# Altium schematic sheet P11-CAMERA AVIN.SchDoc
size 420 x 297 mm
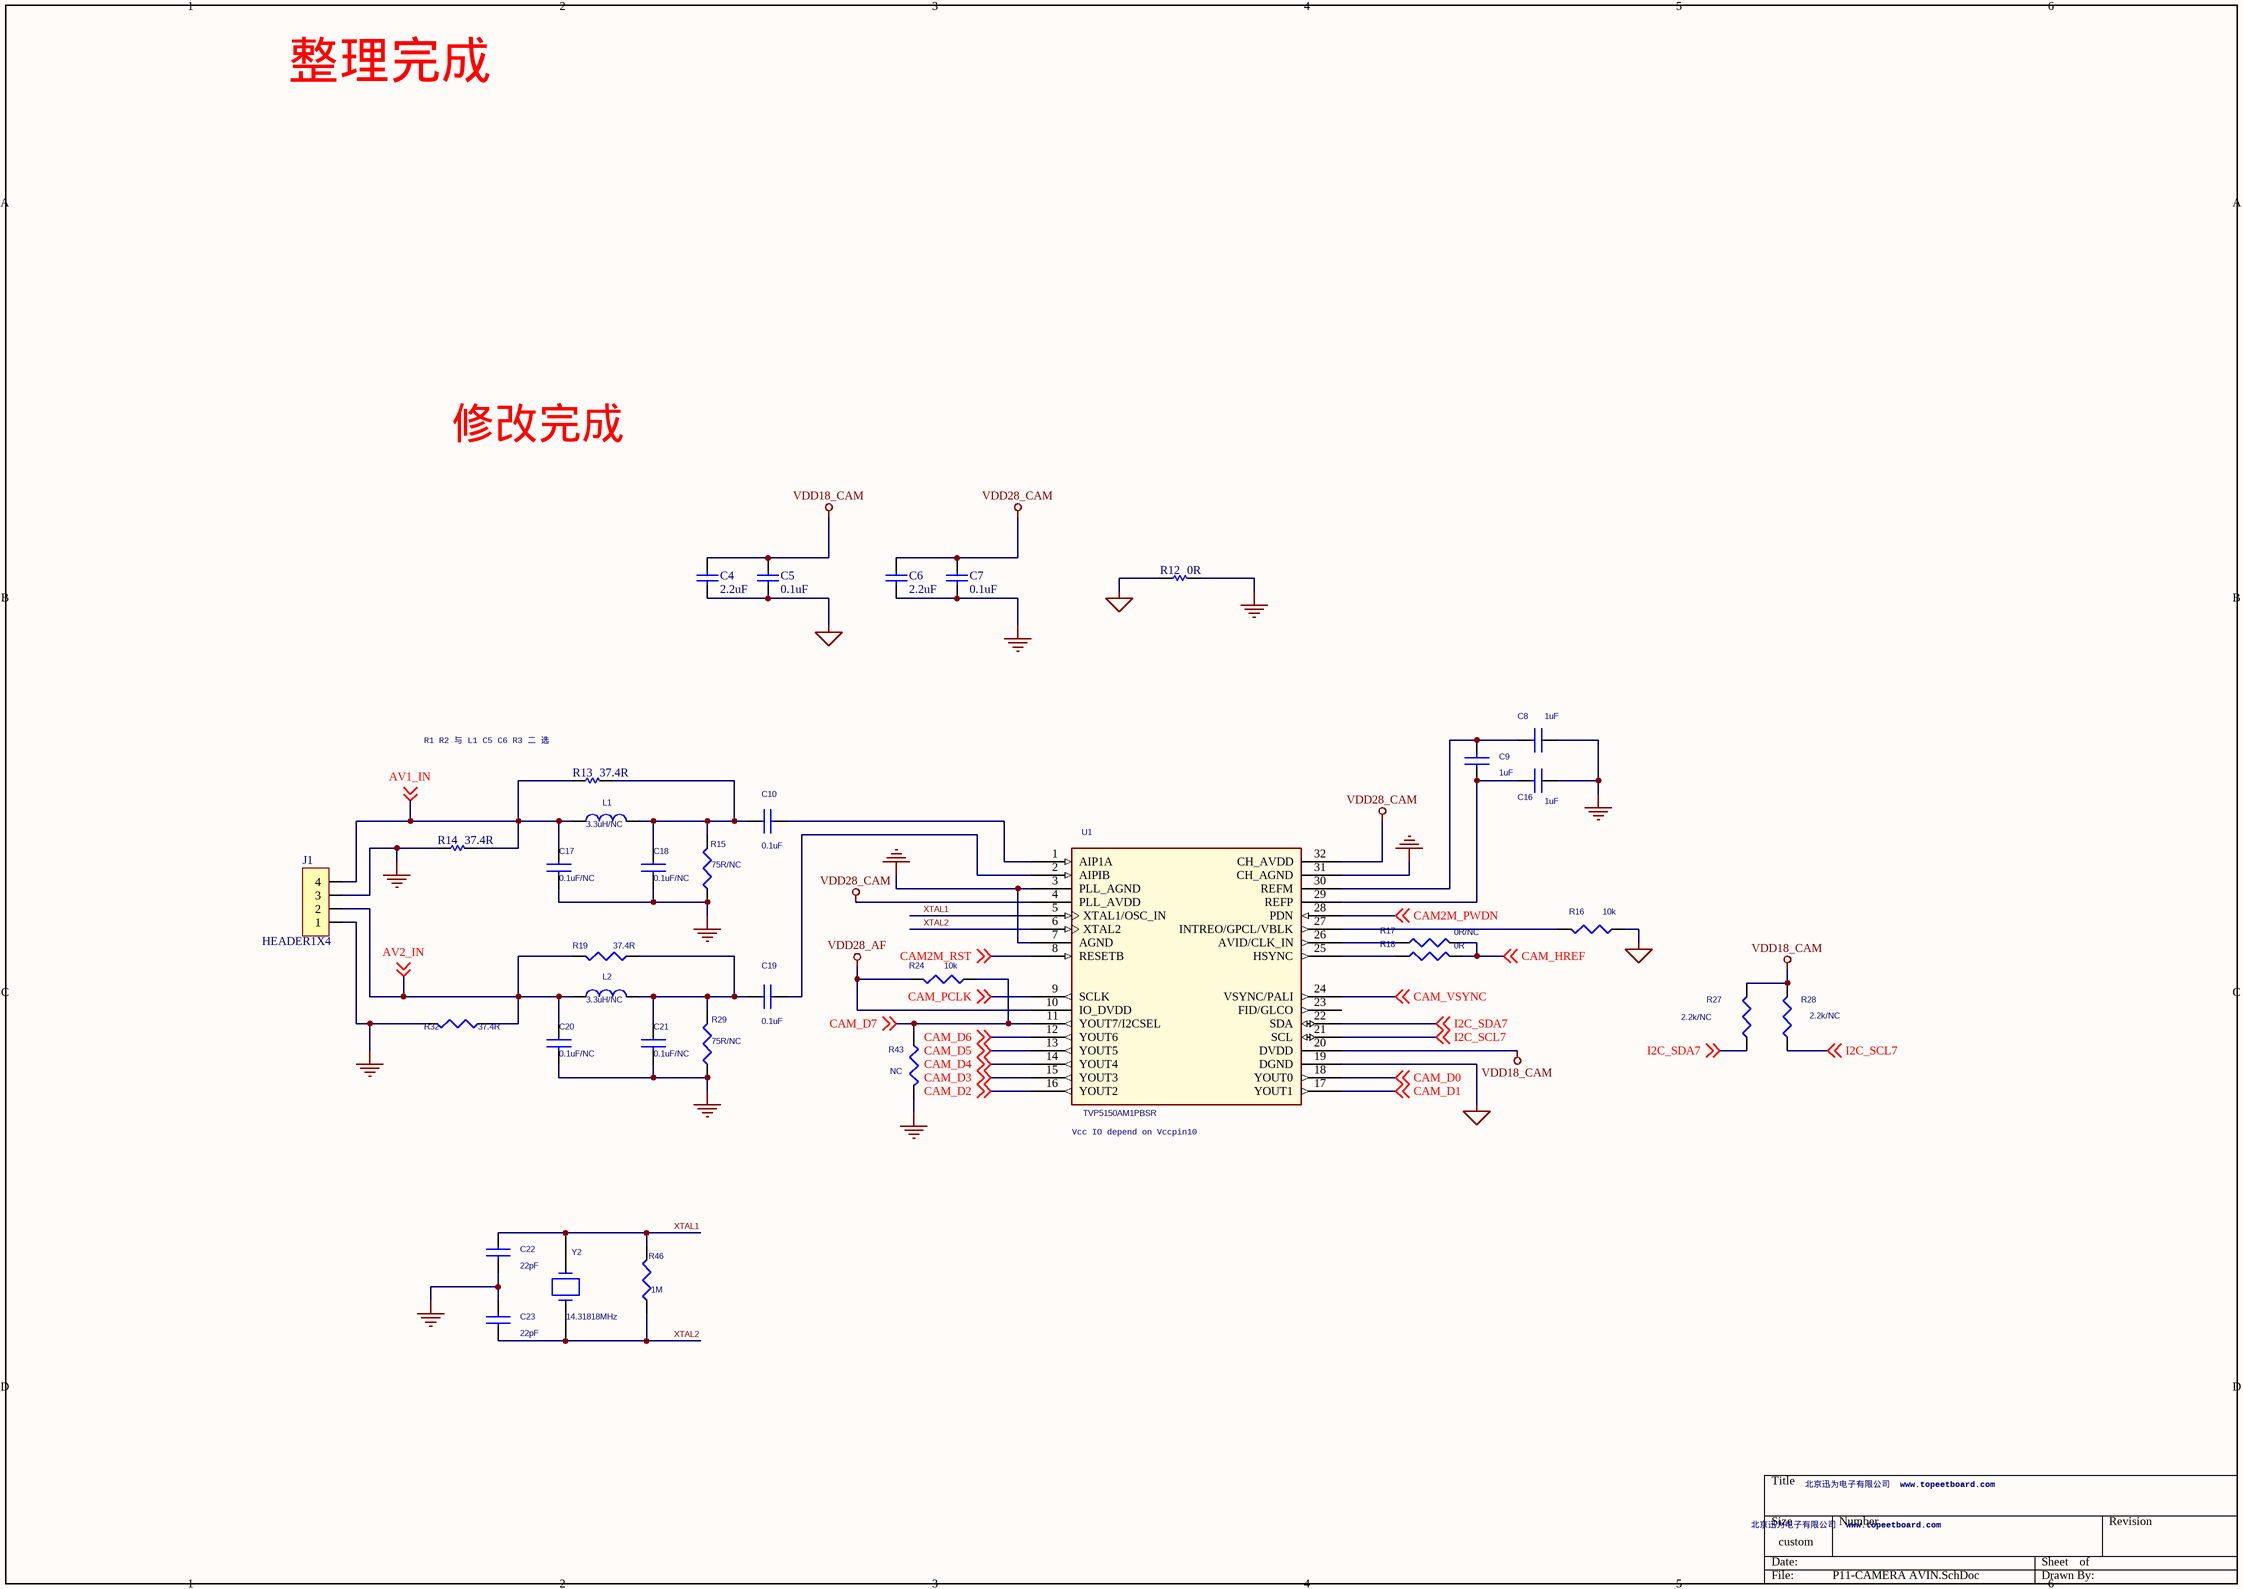
[diagram p0: P11-CAMERA AVIN.SchDoc]

## Parts
C4  2.2uF  [C0603-S]
C5  0.1uF  [C0603-S]
C6  2.2uF  [C0603-S]
C7  0.1uF  [C0603-S]
C8  1uF  [C0603-S]
C9  1uF  [C0603-S]
C10  0.1uF  [C0603-S]
C16  1uF  [C0603-S]
C17  0.1uF/NC  [C0603-S]
C18  0.1uF/NC  [C0603-S]
C19  0.1uF  [C0603-S]
C20  0.1uF/NC  [C0603-S]
C21  0.1uF/NC  [C0603-S]
C22  22pF  [C0603-s]
C23  22pF  [C0603-s]
J1  HEADER1X4  [HD1X4-2.00]
L1  3.3uH/NC  [L4X4-S]
L2  3.3uH/NC  [L4X4-S]
R12  0R  [R0603-S]
R13  37.4R  [R0603-S]
R14  37.4R  [R0603-S]
R15  75R/NC  [R0603-S]
R16  10k  [R0603-S]
R17  0R/NC  [R0603-S]
R18  0R  [R0603-S]
R19  37.4R  [R0603-S]
R24  10k  [R0603-S]
R27  2.2k/NC  [R0603-S]
R28  2.2k/NC  [R0603-S]
R29  75R/NC  [R0603-S]
R32  37.4R  [R0603-S]
R43  NC  [R0603-S]
R46  1M  [R0603-S]
U1  TVP5150AM1PBSR  [PFFQ32]
Y2  14.31818MHz  [CRYSTAL_D200]

## Nets
AGND: C4.1 C5.1 R12.1 R16.1 U1.19(DGND)
GND: C6.1 C7.1 C8.1 C16.1 C17.2 C18.2 C20.2 C21.2 C22.2 C23.1 J1.1 J1.3 R12.2 R14.1 R15.1 R29.1 R32.2 R43.2 U1.3(PLL_AGND) U1.7(AGND) U1.31(CH_AGND)
VDD18_CAM: C4.2 C5.2 R27.2 R28.2 U1.20(DVDD)
VDD28_AF: R24.2 U1.10(IO_DVDD)
VDD28_CAM: C6.2 C7.2 U1.4(PLL_AVDD) U1.32(CH_AVDD)
AV1_IN: C17.1 J1.4 L1.1 R13.1 R14.2 ; off-sheet AV1_IN
AV2_IN: C20.1 J1.2 L2.1 R19.2 R32.1 ; off-sheet AV2_IN
CAM2M_PWDN: U1.28(PDN) ; off-sheet CAM2M_PWDN
CAM2M_RST: U1.8(RESETB) ; off-sheet CAM2M_RST
CAM_D0: U1.18(YOUT0) ; off-sheet CAM_D0
CAM_D1: U1.17(YOUT1) ; off-sheet CAM_D1
CAM_D2: U1.16(YOUT2) ; off-sheet CAM_D2
CAM_D3: U1.15(YOUT3) ; off-sheet CAM_D3
CAM_D4: U1.14(YOUT4) ; off-sheet CAM_D4
CAM_D5: U1.13(YOUT5) ; off-sheet CAM_D5
CAM_D6: U1.12(YOUT6) ; off-sheet CAM_D6
CAM_D7: R24.1 R43.1 U1.11(YOUT7/I2CSEL) ; off-sheet CAM_D7
CAM_HREF: R17.2 R18.2 ; off-sheet CAM_HREF
CAM_PCLK: U1.9(SCLK) ; off-sheet CAM_PCLK
CAM_VSYNC: U1.24(VSYNC/PALI) ; off-sheet CAM_VSYNC
I2C_SCL7: R28.1 U1.21(SCL) ; off-sheet I2C_SCL7
I2C_SDA7: R27.1 U1.22(SDA) ; off-sheet I2C_SDA7
XTAL1: C22.1 R46.2 U1.5(XTAL1/OSC_IN) Y2.2
XTAL2: C23.2 R46.1 U1.6(XTAL2) Y2.1
NetC8_2: C8.2 C9.2 U1.30(REFM)
NetC9_1: C9.1 C16.2 U1.29(REFP)
NetC10_1: C10.1 C18.1 L1.2 R13.2 R15.2
NetC10_2: C10.2 U1.1(AIP1A)
NetC19_1: C19.1 C21.1 L2.2 R19.1 R29.2
NetC19_2: C19.2 U1.2(AIPIB)
NetR16_2: R16.2 U1.27(INTREO/GPCL/VBLK)
NetR17_1: R17.1 U1.26(AVID/CLK_IN)
NetR18_1: R18.1 U1.25(HSYNC)

Not connected (* = marked no-connect by the designer): U1 23(FID/GLCO)

## Notes on the sheet
- 整理完成
- 修改完成
- R1 R2 与 L1 C5 C6 R3 二 选
- (near U1) Vcc IO depend on Vccpin10
- 北京迅为电子有限公司  www.topeetboard.com

## Library data of the parts
C4-C7 = Cap Semi
C8-C10 C16-C21 = C0603_0
C22 C23 = C1005
L1 L2 = LQH32C_0
R12-R14 = Res
R15-R19 R24 R27-R29 R32 R43 R46 = R1005_0
U1 = TVP5151
Y2 = XM/SM